# Altium schematic sheet Solenoid Drivers.SchDoc: Dual Feeder -
size Letter; DrawnBy: Mark Harris; Engineer: Mark Harris; Organization: Mark Harris; ProjectName: Dual Feeder Controller
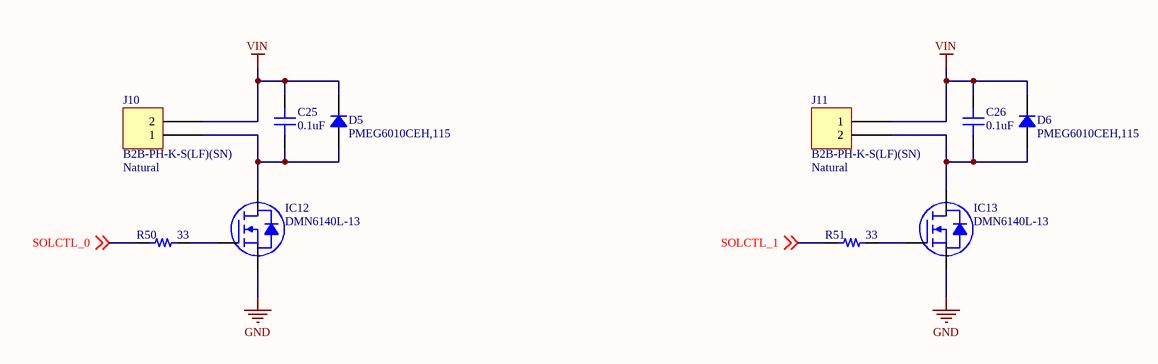
[diagram p0: Solenoid Drivers.SchDoc]

## Parts
C25  0.1uF  [CAP 0603/1608]
C26  0.1uF  [CAP 0603/1608]
D5  PMEG6010CEH,115  [SOD123F]
D6  PMEG6010CEH,115  [SOD123F]
IC12  DMN6140L-13  [DIODES SOT-23-3]
IC13  DMN6140L-13  [DIODES SOT-23-3]
J10  B2B-PH-K-S(LF)(SN)  Colour: Natural  [JST B2B-PH-K]
J11  B2B-PH-K-S(LF)(SN)  Colour: Natural  [JST B2B-PH-K]
R50  33  [RES 0603/1608]
R51  33  [RES 0603/1608]

## Nets
GND: IC12.3(S) IC13.3(S)
VIN: C25.1 C26.1 D5.2 D6.2 J10.2 J11.1
SOLCTL_0: R50.1 ; off-sheet SOLCTL_0
SOLCTL_1: R51.1 ; off-sheet SOLCTL_1
NetC25_2: C25.2 D5.1 IC12.2(D) J10.1
NetC26_2: C26.2 D6.1 IC13.2(D) J11.2
NetIC12_1: IC12.1(G) R50.2
NetIC13_1: IC13.1(G) R51.2

## Notes on the sheet
- Title
- Size:
- Date:
- Letter
- Number:
- Time:
- Revision:
- Sheet
- of
- File:

## Library data of the parts
C25 C26 = CL10B104JB8NNNC: CAP CER 0.1UF 50V X7R 0603; Manufacturer: Samsung Electro-Mechanics America, Inc.; TemperatureRange: -55C ~ 125C; Tolerance: 5%; Value: 0.1uF; Part Number: CL10B104JB8NNNC; PartId: 5416; Supplier 1: Digi-Key; Supplier Part Number 1: 1276-1033-2-ND; ComponentLink1Description: Datasheet; ComponentLink1URL: http://www.samsungsem.com/kr/support/product-search/mlcc/CL10B104JB8NNNC.jsp; ComponentLink2Description: Digi-Key listing; ComponentLink2URL: http://digikey.com/product-detail/en/CL10B104JB8NNNC/1276-1033-2-ND/3886691; TemperatureCoefficient: X7R; Voltage: 50V; Price: 0.0132; Type: -; Device Package: 0603 (1608 Metric)
D5 D6 = PMEG6010CEH,115: DIODE SCHOTTKY 60V 1A SOD123F; Manufacturer: NXP USA Inc.; Current Reverse Leakage @ Vr: 50uA @ 60V; Current Rectified: 1A (DC); Voltage Forward (Vf): 660mV @ 1A; Part Number: PMEG6010CEH,115; PartId: 29169; Supplier 1: Digi-Key; Supplier Part Number 1: 568-4104-1-ND; ComponentLink1Description: Datasheet; ComponentLink1URL: http://www.nxp.com/documents/data_sheet/PMEG6010CEH_PMEG6010CEJ.pdf; ComponentLink2Description: Digi-Key Listing; ComponentLink2URL: https://www.digikey.com/product-detail/en/nxp-usa-inc/PMEG6010CEH,115/568-4104-1-ND/1589917; Junction Operating Temperature: 150C (Max); Price: 0.38; Type: Schottky; Device Package: SOD-123F; Voltage DC Reverse (Vr): 60V
IC12 IC13 = DMN6140L-13: MOSFET N-CH 60V 1.6A SOT23; Manufacturer: Diodes Incorporated; Rds On (Max) at Id, Vgs: 140 mOhm @ 1.8A, 10V; Vgs(th) (Max) at Id: 20V; Gate Charge (Qg): 8.6nC @ 10V; Input Capacitance (Ciss) at Vds: 315pF @ 40V; Current Continuous Drain: 1.6A (Ta); Part Number: DMN6140L-13; PartId: 29565; Supplier 1: Digi-Key; Supplier Part Number 1: DMN6140L-13DICT-ND; ComponentLink1Description: Datasheet; ComponentLink1URL: http://diodes.com/_files/datasheets/DMN6140L.pdf; ComponentLink2Description: Digi-Key Listing; ComponentLink2URL: https://www.digikey.com/product-detail/en/diodes-incorporated/DMN6140L-13/DMN6140L-13DICT-ND/5218250; Price: 0.51; Type: N-Channel; Device Package: TO-236-3, SC-59, SOT-23-3; Drain to Source Voltage (Vdss): 60V
J10 J11 = B2B-PH-K-S(LF)(SN): CONN HEADER PH TOP 2POS 2MM; Manufacturer: JST Sales America Inc.; Pitch: 0.079" (2.00mm); Number Of Positions: 2; Part Number: B2B-PH-K-S(LF)(SN); PartId: 29447; Supplier 1: Digi-Key; Supplier Part Number 1: 455-1704-ND; ComponentLink1Description: Datasheet; ComponentLink1URL: http://www.jst-mfg.com/product/pdf/eng/ePH.pdf; ComponentLink2Description: Digi-Key Listing; ComponentLink2URL: http://www.digikey.com/product-detail/en/jst-sales-america-inc/B2B-PH-K-S(LF)(SN)/455-1704-ND/926611; Price: 0.17; Type: Header, Shrouded; Contact Finish: Tin; Fastening Type: Detent Lock; Number Of Rows: 1; Series: PH
R50 R51 = ERJ-3EKF33R0V: RES SMD 33 OHM 1% 1/10W 0603; Manufacturer: Panasonic Electronic Components; TemperatureRange: -55C ~ 155C; TemperatureCoefficient: 100ppm/C; PowerRating: 0.1W, 1/10W; Value: 33; Part Number: ERJ-3EKF33R0V; PartId: 901; Supplier 1: Digi-Key; Supplier Part Number 1: P33.0HTR-ND; ComponentLink1Description: Datasheet; ComponentLink1URL: http://industrial.panasonic.com/www-cgi/jvcr13pz.cgi?E+PZ+3+AOA0002+ERJ3EKF33R0V+7+WW; ComponentLink2Description: Digi-Key listing; ComponentLink2URL: http://digikey.com/product-detail/en/ERJ-3EKF33R0V/P33.0HTR-ND/1746383; Tolerance: 1%; Price: 0.0038; Type: Thick Film; Device Package: 0603 (1608 Metric)